# EAGLE design joystick (EAGLE 9.6.2)
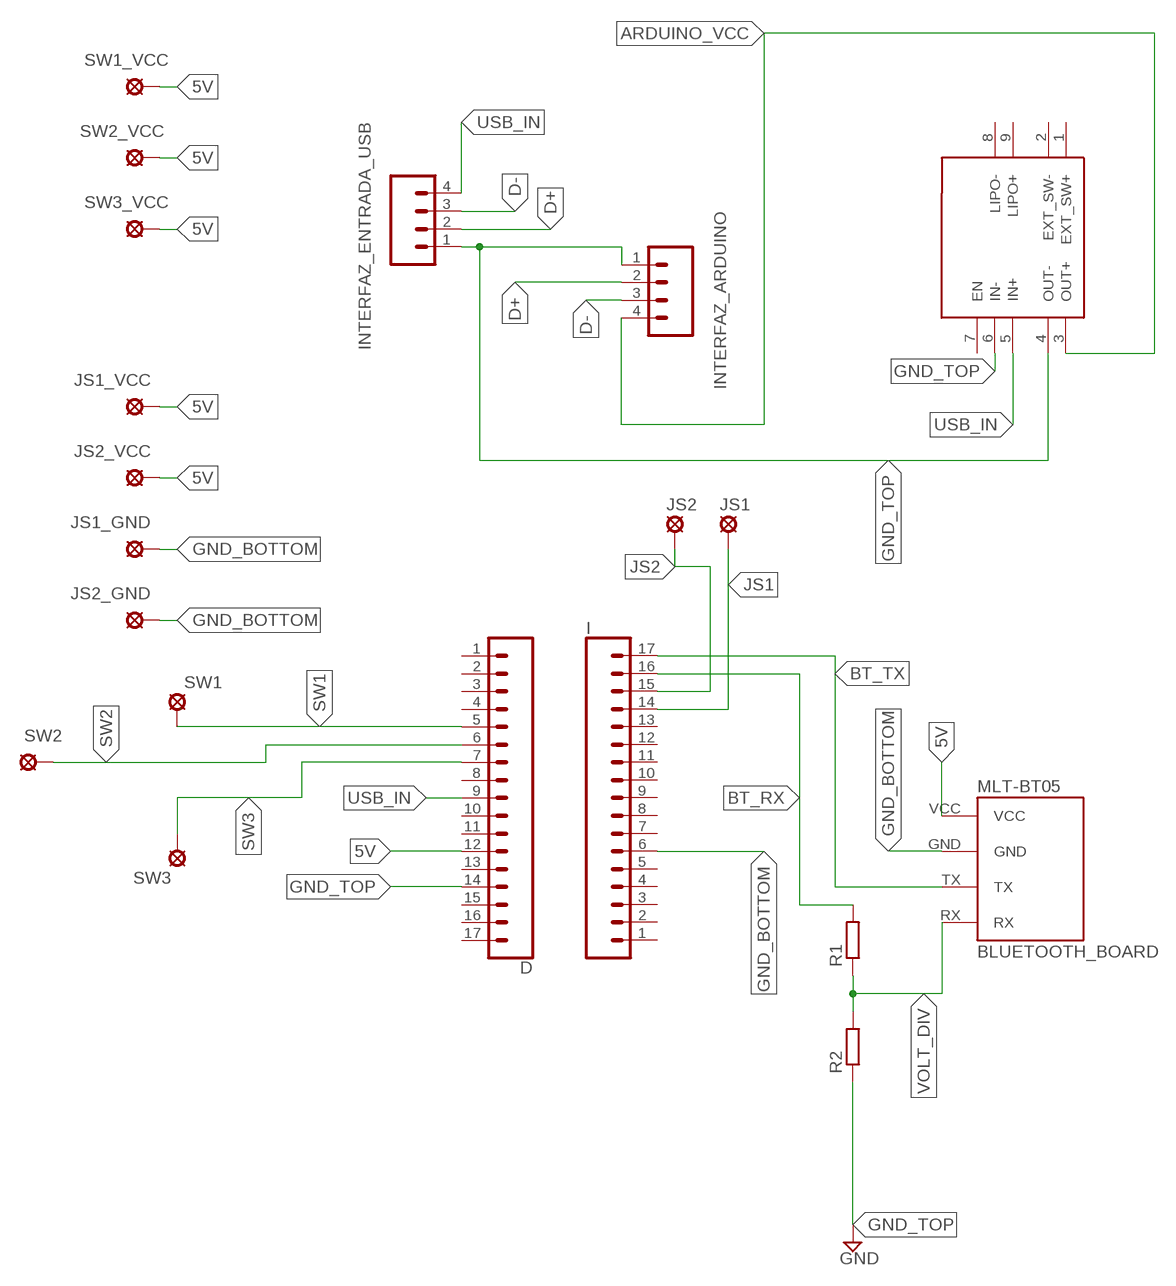
[diagram p0: schematic, sheet 1]

## Parts
D  CONN_17  [1X17]
I  CONN_17  [1X17]
INTERFAZ_ARDUINO  CONN_04  [1X04]
INTERFAZ_ENTRADA_USB  CONN_04  [1X04]
JS1  MCS08  [MCS08]
JS1_GND  MCS08  [MCS08]
JS1_VCC  MCS08  [MCS08]
JS2  MCS08  [MCS08]
JS2_GND  MCS08  [MCS08]
JS2_VCC  MCS08  [MCS08]
LIPO_BOOSTER  LIP_CHARGER_LAYOUT  [LIP_CHARGER_FOOTPRINT]
MLT-BT05  BLUETOOTH_BOARD  [BT_BOARD_FOOTPRINT]
R1  R-EU_R0805  [R0805]
R2  R-EU_R0805  [R0805]
SW1  MCS08  [MCS08]
SW1_VCC  MCS08  [MCS08]
SW2  MCS08  [MCS08]
SW2_VCC  MCS08  [MCS08]
SW3  MCS08  [MCS08]
SW3_VCC  MCS08  [MCS08]

## Nets
5V: D.12 JS1_VCC.MP JS2_VCC.MP MLT-BT05.VCC SW1_VCC.MP SW2_VCC.MP SW3_VCC.MP
ARDUINO_VCC: INTERFAZ_ARDUINO.4 LIPO_BOOSTER.3(OUT+)
BT_RX: I.16 R1.2
BT_TX: I.17 MLT-BT05.TX
D+: INTERFAZ_ARDUINO.2 INTERFAZ_ENTRADA_USB.2
D-: INTERFAZ_ARDUINO.3 INTERFAZ_ENTRADA_USB.3
GND_BOTTOM: I.6 JS1_GND.MP JS2_GND.MP MLT-BT05.GND
GND_TOP: D.14 INTERFAZ_ARDUINO.1 INTERFAZ_ENTRADA_USB.1 LIPO_BOOSTER.4(OUT-) LIPO_BOOSTER.6(IN-) R2.1 ; supply symbol labelled GND
JS1: I.14 JS1.MP
JS2: I.15 JS2.MP
SW1: D.5 SW1.MP
SW2: D.6 SW2.MP
SW3: D.7 SW3.MP
USB_IN: D.9 INTERFAZ_ENTRADA_USB.4 LIPO_BOOSTER.5(IN+)
VOLT_DIV: MLT-BT05.RX R1.1 R2.2
Unconnected: D.1 D.2 D.3 D.4 D.8 D.10 D.11 D.13 D.15 D.16 D.17 I.1 I.2 I.3 I.4 I.5 I.7 I.8 I.9 I.10 I.11 I.12 I.13 LIPO_BOOSTER.1(EXT_SW+) LIPO_BOOSTER.2(EXT_SW-) LIPO_BOOSTER.7(EN) LIPO_BOOSTER.8(LIPO-) LIPO_BOOSTER.9(LIPO+)

## Library data of the parts
D I = SparkFun-Connectors:CONN_17: Multi connection point. Often used as Generic Header-pin footprint for 0.1 inch spaced/style header connections On any of the 0.1 inch spaced packages, you can populate with these: Break Away Headers - Straight <https://www.sparkfun.com/products/116> (PRT-00116) Break Away Male Headers - Right Angle <https://www.sparkfun.com/products/553> (PRT-00553) Female Headers <https://www.sparkfun.com/products/115> (PRT-00115) Break Away Headers - Machine Pin <https://www.sparkfun.com/products/117> (PRT-00117) Break Away Female Headers - Swiss Machine Pin <https://www.sparkfun.com/products/743> (PRT-00743) For SCREWTERMINALS and SPRING TERMINALS visit here: Screw Terimnals on SparkFun.com <https://www.sparkfun.com/search/results?term=Screw+Terminals> (5mm/3.5mm/2.54mm spacing) This device is also useful as a general connection point to wire up your design to another part of your project. Our various solder wires solder well into these plated through hole pads. Hook-Up Wire - Assortment (Stranded, 22 AWG) <https://www.sparkfun.com/products/11375> (PRT-11375) Hook-Up Wire - Assortment (Solid Core, 22 AWG) <https://www.sparkfun.com/products/11367> (PRT-11367) View the entire wire category on our website here <https://www.sparkfun.com/categories/141> Special notes: Molex polarized connector foot print use with SKU : PRT-08231 with associated crimp pins and housings. 1MM SMD Version SKU: PRT-10208 NOTES ON THE VARIANTS LOCK and LOCK_LONGPADS... This footprint was designed to help hold the alignment of a through-hole component (i.e. 6-pin header) while soldering it into place. You may notice that each hole has been shifted either up or down by 0.005 of an inch from it's more standard position (which is a perfectly straight line). This slight alteration caused the pins (the squares in the middle) to touch the edges of the holes. Because they are alternating, it causes a "brace" to hold the component in place. 0.005 has proven to be the perfect amount of "off-center" position when using our standard breakaway headers. Although looks a little odd when you look at the bare footprint, once you have a header in there, the alteration is very hard to notice. Also,if you push a header all the way into place, it is covered up entirely on the bottom side.
INTERFAZ_ARDUINO INTERFAZ_ENTRADA_USB = SparkFun-Connectors:CONN_04: Multi connection point. Often used as Generic Header-pin footprint for 0.1 inch spaced/style header connections On any of the 0.1 inch spaced packages, you can populate with these: Break Away Headers - Straight <https://www.sparkfun.com/products/116> (PRT-00116) Break Away Male Headers - Right Angle <https://www.sparkfun.com/products/553> (PRT-00553) Female Headers <https://www.sparkfun.com/products/115> (PRT-00115) Break Away Headers - Machine Pin <https://www.sparkfun.com/products/117> (PRT-00117) Break Away Female Headers - Swiss Machine Pin <https://www.sparkfun.com/products/743> (PRT-00743) For SCREWTERMINALS and SPRING TERMINALS visit here: Screw Terimnals on SparkFun.com <https://www.sparkfun.com/search/results?term=Screw+Terminals> (5mm/3.5mm/2.54mm spacing) This device is also useful as a general connection point to wire up your design to another part of your project. Our various solder wires solder well into these plated through hole pads. Hook-Up Wire - Assortment (Stranded, 22 AWG) <https://www.sparkfun.com/products/11375> (PRT-11375) Hook-Up Wire - Assortment (Solid Core, 22 AWG) <https://www.sparkfun.com/products/11367> (PRT-11367) View the entire wire category on our website here <https://www.sparkfun.com/categories/141> Special notes: Molex polarized connector foot print use with SKU : PRT-08231 with associated crimp pins and housings. 1MM SMD Version SKU: PRT-10208; PROD_ID: CONN-09696
JS1 JS1_GND JS1_VCC JS2 JS2_GND JS2_VCC SW1 SW1_VCC SW2 SW2_VCC SW3 SW3_VCC = solpad:MCS08: SOLDER PAD MC S0,8, drill 1.2 mm, distributor Buerklin, 08F130
LIPO_BOOSTER = sparkfun_lip_charger:LIP_CHARGER_LAYOUT: A SparkFun lip charger rev 10 layout
MLT-BT05 = Bluetooth HC-05:BLUETOOTH_BOARD: Bluetooth Board V1.05
R1 R2 = rcl:R-EU_: RESISTOR, European symbol; SPICEPREFIX: R

## Board
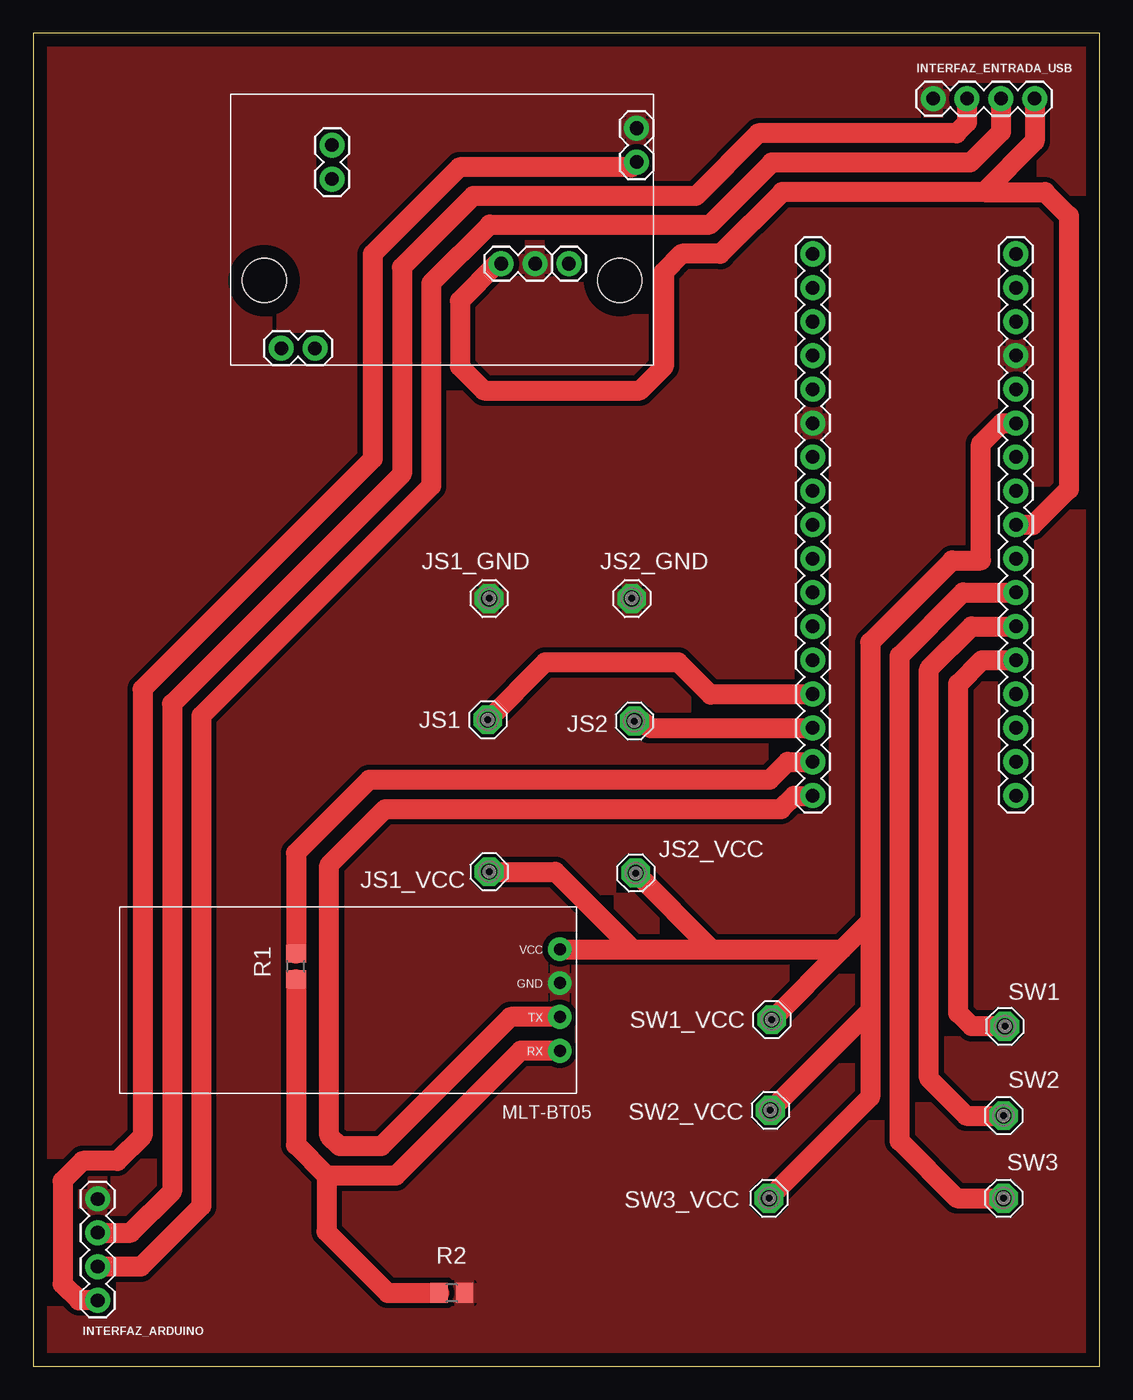
[diagram p1: board, top side]
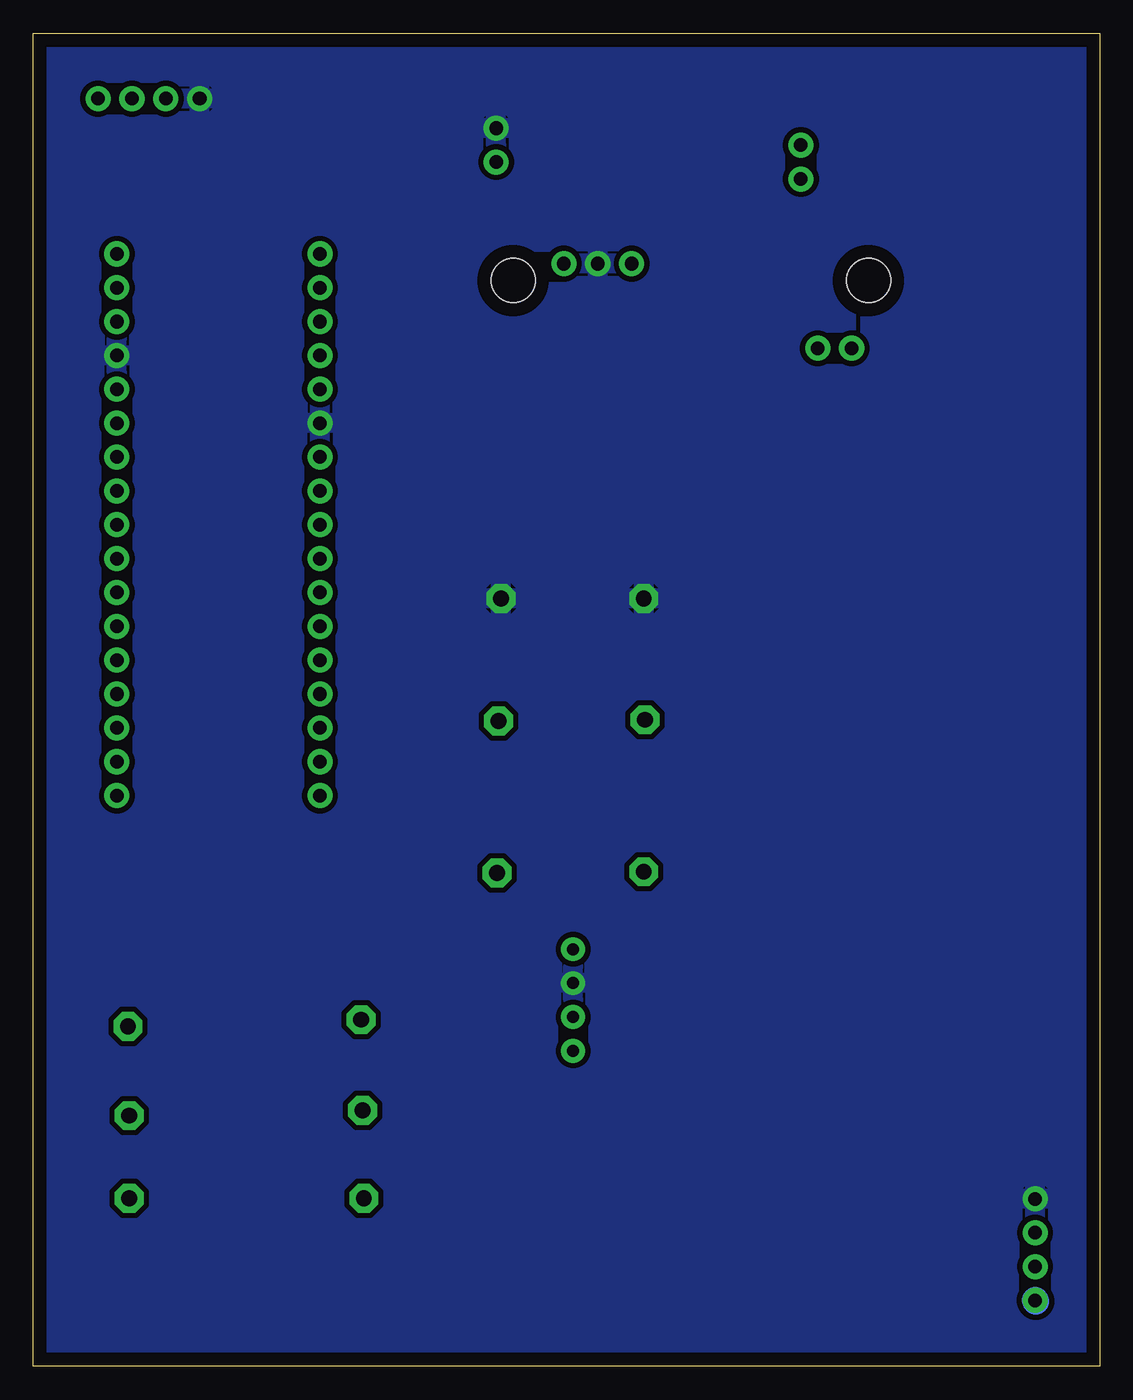
[diagram p2: board, bottom side, seen from below]

Size 80 x 100 mm. Coordinates in mm from the lower left corner, seen from the top.
Outline: 0,0 80,0 80,100 0,100 0,0
Copper layers (1*16): Top 0.035mm / dielectric 1.5mm / Bottom 0.035mm
Design rules "default": minimum track width 6mil, minimum drill 0.35mm, track to track 6mil, track to pad 6mil, pad to pad 6mil, via to via 6mil, smd to smd 6mil, copper to edge 40mil, drill to drill 6mil, minimum pad ring 10mil, minimum via ring 8mil, stop-mask expansion 4mil, vias tented up to drill 0mil, thermal gap 10mil

### Footprints (pad centres in the part's own frame; a part is rotated, then mirrored left to right if it is on the bottom)
1X17 = drill 1.016 pad 1.88: 1 0,0; 2 2.54,0; 3 5.08,0; 4 7.62,0; 5 10.16,0; 6 12.7,0; 7 15.24,0; 8 17.78,0; 9 20.32,0; 10 22.86,0; 11 25.4,0; 12 27.94,0; 13 30.48,0; 14 33.02,0; 15 35.56,0; 16 38.1,0; 17 40.64,0
1X04 = drill 1.016 pad 1.88: 1 0,0; 2 2.54,0; 3 5.08,0; 4 7.62,0
MCS08 = drill 1.194 pad 2.159 octagon: MP 0,0
LIP_CHARGER_FOOTPRINT = drill 1.016 pad 1.88: 1 1.27,27.94; 2 1.27,25.4; 3 15.24,1.27; 4 17.78,1.27; 5 7.62,11.43; 6 7.62,8.89; 7 7.62,6.35; 8 13.97,24.13; 9 16.51,24.13 | hole 3.302: 6.35,2.54; 6.35,29.21
BT_BOARD_FOOTPRINT = drill 0.9 pad 1.778: GND -16.51,-1.27; RX -16.51,3.81; TX -16.51,1.27; VCC -16.51,-3.81
R0805 = smd 1.3 x 1.5: 1 -0.95,0; 2 0.95,0

### Placement (x,y rotation side)
D  73.73,42.81 90 top
I  58.49,83.45 270 top
INTERFAZ_ARDUINO  4.83,12.55 270 top
INTERFAZ_ENTRADA_USB  67.52,95.1 0 top
JS1  34.1,48.5 0 top
JS1_GND  34.2,57.6 0 top
JS1_VCC  34.2,37.1 0 top
JS2  45.1,48.4 0 top
JS2_GND  44.9,57.6 0 top
JS2_VCC  45.2,37 0 top
LIPO_BOOSTER  46.54,75.1 90 top
MLT-BT05  22.99,27.47 180 top
R1  19.7,30 90 top
R2  31.4,5.5 180 top
SW1  72.9,25.5 0 top
SW1_VCC  55.4,26 0 top
SW2  72.8,18.8 0 top
SW2_VCC  55.3,19.2 0 top
SW3  72.8,12.6 0 top
SW3_VCC  55.2,12.6 0 top

### Tracks (layer width: path | path; a pad name or v marks a point on that pad's centre or on a via)
5V
  Top 1.5: 62.8,33.4 60.68,31.28 | 60.68,31.28 SW1_VCC.MP | 62.8,33.4 62.8,54.3 68.95,60.45 71.1,60.45 71.1,69.2 72.65,70.75 D.12 | MLT-BT05.VCC 45,31.28 | 45,31.28 50.92,31.28 | 50.92,31.28 60.68,31.28 | 62.8,33.4 62.8,26.7 | 62.8,26.7 SW2_VCC.MP | 62.8,26.7 62.8,20.2 SW3_VCC.MP | 50.92,31.28 JS2_VCC.MP | 45,31.28 39.18,37.1 JS1_VCC.MP
ARDUINO_VCC
  Top 1.5: INTERFAZ_ARDUINO.4 3.43,4.93 2.2,6.16 2.2,13.9 3.7,15.4 6.3,15.4 8.2,17.3 8.2,50.8 25.46,68.06 25.46,83.44 31.97,89.94 44.87,89.94 LIPO_BOOSTER.3
  Bottom 2: INTERFAZ_ARDUINO.4 4.78,4.88
BT_RX
  Top 1.5: I.16 56.59,45.35 55.24,44 25.2,44 19.7,38.5 R1.2
BT_TX
  Top 1.5: 39.35,26.35 MLT-BT05.TX 35.8,26.2 26.1,16.5 23,16.5 22.2,17.3 22.2,37.6 26.4,41.8 56.1,41.8 57.1,42.8 I.17
D+
  Top 1.5: INTERFAZ_ENTRADA_USB.2 70.06,93.3 69.26,92.5 54.4,92.5 49.7,87.8 33,87.8 27.65,82.45 27.65,66.95 10.4,49.7 10.4,13.1 7.31,10.01 INTERFAZ_ARDUINO.2
D-
  Top 1.5: INTERFAZ_ENTRADA_USB.3 72.6,92.6 70.3,90.3 55.4,90.3 50.75,85.65 34.25,85.65 29.85,81.25 29.85,66.05 12.6,48.8 12.6,12 8.07,7.47 INTERFAZ_ARDUINO.3
GND_BOTTOM
  pour Top (isolate 0.4): 0,100.1 0,-0.4 80.3,-0.4 80.8,0.1 80.8,100.4 0.3,100.4
  pour Bottom (isolate 0.4): -0.5,100.8 -0.5,-0.4 -0.3,-0.6 80.3,-0.6 80.5,-0.4 80.5,100.2 0.1,100.2
GND_TOP
  pour Top (isolate 0.4): -0.5,100.6 -0.5,-0.6 -0.4,-0.7 80.6,-0.7 80.9,-0.4 80.9,100.4 80.7,100.6
  pour Bottom (isolate 0.4): -0.5,100.6 -0.5,-0.7 -0.4,-0.8 80.6,-0.8 81.1,-0.3 81.1,99.7 80.1,100.7 -0.4,100.7
JS1
  Top 1.5: JS1.MP 38.4,52.8 48.4,52.8 50.81,50.39 58.45,50.39 I.14
JS2
  Top 1.5: 45,48.4 JS2.MP 45.7,48.4 46.21,47.89 I.15
SW1
  Top 1.5: SW1.MP 70.4,25.5 69.4,26.5 69.4,51.19 71.18,52.97 D.5
SW2
  Top 1.5: SW2.MP 70,18.8 67.2,21.6 67.2,52.3 70.41,55.51 D.6
SW3
  Top 1.5: SW3.MP 69.3,12.6 65,16.9 65,53.3 69.75,58.05 D.7
USB_IN
  Top 1.5: INTERFAZ_ENTRADA_USB.4 75.14,91.9 71.34,88.1 | 71.34,88.1 56.2,88.1 51.55,83.45 48.65,83.45 47.3,82.1 47.3,75 45.5,73.2 33.81,73.2 32.01,75 32.01,79.92 34.81,82.72 LIPO_BOOSTER.5 | 71.34,88.1 75.9,88.1 77.7,86.3 77.7,65.8 74.99,63.09 73.77,63.09 D.9
VOLT_DIV
  Top 1.5: MLT-BT05.RX 36.56,23.66 27.2,14.3 22,14.3 | 22,14.3 22,10.09 26.59,5.5 R2.2 | R1.1 19.7,16.6 22,14.3